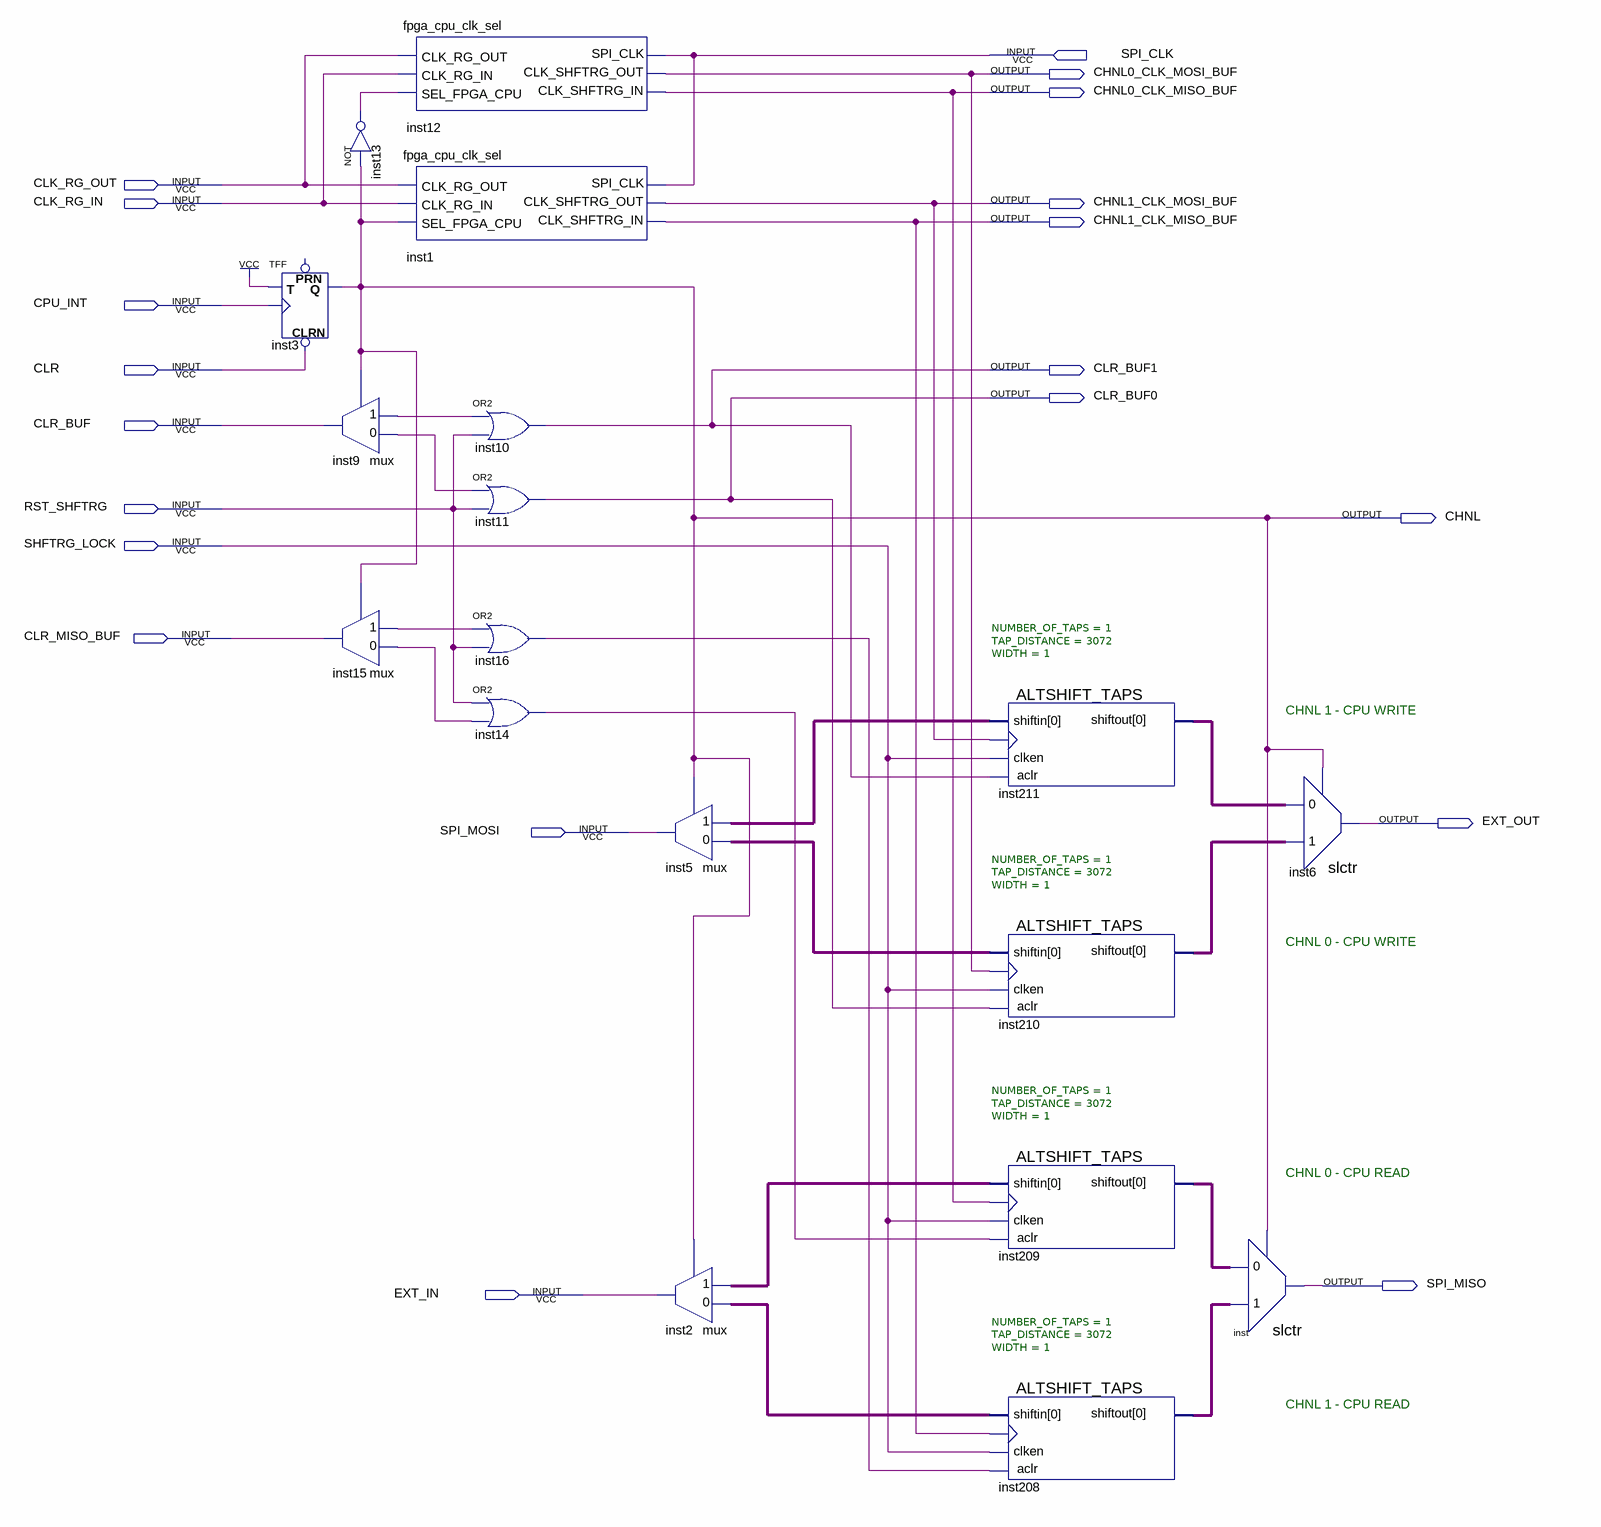
[diagram p0: schematic sheet]
// Quartus schematic DBL_BUF.bdf as structural Verilog: 18 symbols, 20 pins
module DBL_BUF (
  input  SPI_CLK,
  input  CLK_RG_OUT,
  input  CLK_RG_IN,
  input  CPU_INT,
  input  CLR,
  input  CLR_BUF,
  input  RST_SHFTRG,
  input  SHFTRG_LOCK,
  input  CLR_MISO_BUF,
  input  SPI_MOSI,
  input  EXT_IN,
  output CHNL0_CLK_MOSI_BUF,
  output CHNL0_CLK_MISO_BUF,
  output CHNL1_CLK_MOSI_BUF,
  output CHNL1_CLK_MISO_BUF,
  output CLR_BUF1,
  output CLR_BUF0,
  output CHNL,
  output EXT_OUT,
  output SPI_MISO
);

  wire inst2_out0, inst2_out1, inst5_out0, inst5_out1, inst9_out0, inst9_out1, inst13_out, inst14_out,
       inst15_out0, inst15_out1, inst16_out, inst208_shiftout, inst209_shiftout, inst210_shiftout,
       inst211_shiftout;

  TFF inst3 (.CLRN(CLR), .T(1'b1), .CLK(CPU_INT), .Q(CHNL));  // open: PRN
  mux inst9 (.SEL(CHNL), .In(CLR_BUF), .Out1(inst9_out1), .Out0(inst9_out0));
  mux inst15 (.SEL(CHNL), .In(CLR_MISO_BUF), .Out1(inst15_out1), .Out0(inst15_out0));
  fpga_cpu_clk_sel inst12 (
    .SPI_CLK(SPI_CLK), .CLK_RG_OUT(CLK_RG_OUT), .CLK_RG_IN(CLK_RG_IN), .SEL_FPGA_CPU(inst13_out),
    .CLK_SHFTRG_OUT(CHNL0_CLK_MOSI_BUF), .CLK_SHFTRG_IN(CHNL0_CLK_MISO_BUF));
  not inst13 (inst13_out, CHNL);
  fpga_cpu_clk_sel inst1 (
    .SPI_CLK(SPI_CLK), .CLK_RG_OUT(CLK_RG_OUT), .CLK_RG_IN(CLK_RG_IN), .SEL_FPGA_CPU(CHNL),
    .CLK_SHFTRG_OUT(CHNL1_CLK_MOSI_BUF), .CLK_SHFTRG_IN(CHNL1_CLK_MISO_BUF));
  or inst10 (CLR_BUF1, inst9_out1, RST_SHFTRG);
  or inst11 (CLR_BUF0, inst9_out0, RST_SHFTRG);
  or inst16 (inst16_out, inst15_out1, RST_SHFTRG);
  or inst14 (inst14_out, RST_SHFTRG, inst15_out0);
  mux inst5 (.SEL(CHNL), .In(SPI_MOSI), .Out1(inst5_out1), .Out0(inst5_out0));
  mux inst2 (.SEL(CHNL), .In(EXT_IN), .Out1(inst2_out1), .Out0(inst2_out0));
  ALTSHIFT_TAPS #(.NUMBER_OF_TAPS(1), .TAP_DISTANCE(3072), .WIDTH(1)) inst211 (
    .aclr(CLR_BUF1), .clken(SHFTRG_LOCK), .clock(CHNL1_CLK_MOSI_BUF), .shiftin(inst5_out1),
    .shiftout(inst211_shiftout));
  ALTSHIFT_TAPS #(.NUMBER_OF_TAPS(1), .TAP_DISTANCE(3072), .WIDTH(1)) inst210 (
    .aclr(CLR_BUF0), .clken(SHFTRG_LOCK), .clock(CHNL0_CLK_MOSI_BUF), .shiftin(inst5_out0),
    .shiftout(inst210_shiftout));
  ALTSHIFT_TAPS #(.NUMBER_OF_TAPS(1), .TAP_DISTANCE(3072), .WIDTH(1)) inst209 (
    .aclr(inst14_out), .clken(SHFTRG_LOCK), .clock(CHNL0_CLK_MISO_BUF), .shiftin(inst2_out1),
    .shiftout(inst209_shiftout));
  ALTSHIFT_TAPS #(.NUMBER_OF_TAPS(1), .TAP_DISTANCE(3072), .WIDTH(1)) inst208 (
    .aclr(inst16_out), .clken(SHFTRG_LOCK), .clock(CHNL1_CLK_MISO_BUF), .shiftin(inst2_out0),
    .shiftout(inst208_shiftout));
  slctr inst6 (.SEL(CHNL), .In0(inst211_shiftout), .In1(inst210_shiftout), .Out(EXT_OUT));
  slctr inst (.SEL(CHNL), .In0(inst209_shiftout), .In1(inst208_shiftout), .Out(SPI_MISO));

  // Notes on the sheet:
  //   CHNL 1 - CPU WRITE
  //   CHNL 0 - CPU WRITE
  //   CHNL 0 - CPU READ
  //   CHNL 1 - CPU READ
endmodule
